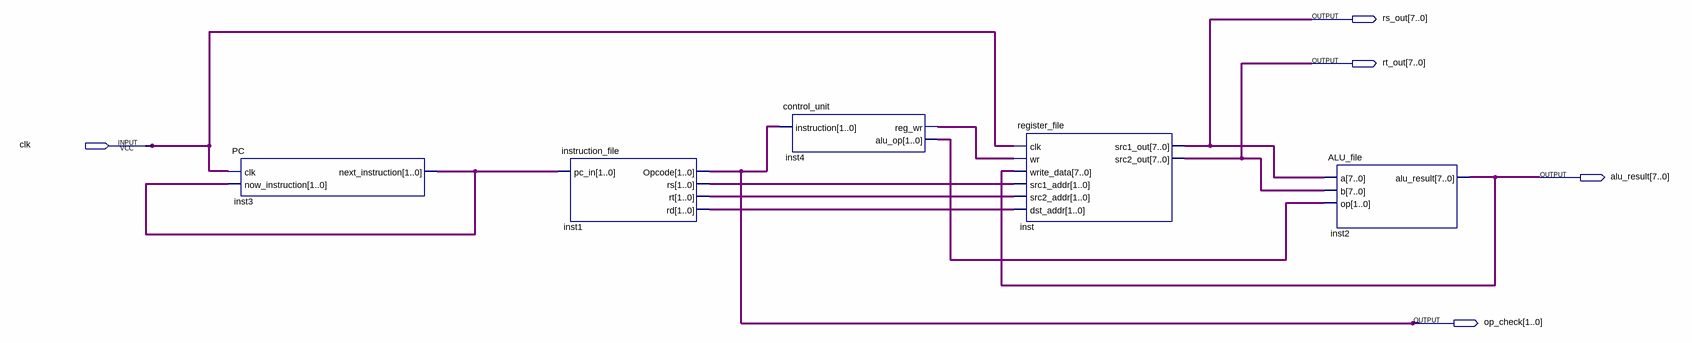
[diagram p0: schematic sheet]
// Quartus schematic all_total.bdf as structural Verilog: 5 symbols, 5 pins
module all_total (
  input  clk,
  output [7:0] rs_out,
  output [7:0] rt_out,
  output [7:0] alu_result,
  output [1:0] op_check
);

  wire inst4_reg_wr;
  wire [1:0] inst1_rd, inst1_rs, inst1_rt, inst3_next_instruction, inst4_alu_op;

  PC inst3 (.clk(clk), .now_instruction(inst3_next_instruction), .next_instruction(inst3_next_instruction));
  instruction_file inst1 (
    .pc_in(inst3_next_instruction), .Opcode(op_check), .rs(inst1_rs), .rt(inst1_rt), .rd(inst1_rd));
  control_unit inst4 (.instruction(op_check), .reg_wr(inst4_reg_wr), .alu_op(inst4_alu_op));
  register_file inst (
    .clk(clk), .wr(inst4_reg_wr), .write_data(alu_result), .src1_addr(inst1_rs), .src2_addr(inst1_rt),
    .dst_addr(inst1_rd), .src1_out(rs_out), .src2_out(rt_out));
  ALU_file inst2 (.a(rs_out), .b(rt_out), .op(inst4_alu_op), .alu_result(alu_result));
endmodule
